# Altium schematic sheet Sensors.SchDoc
size A4; SheetNumber: 3; SheetTotal: 4
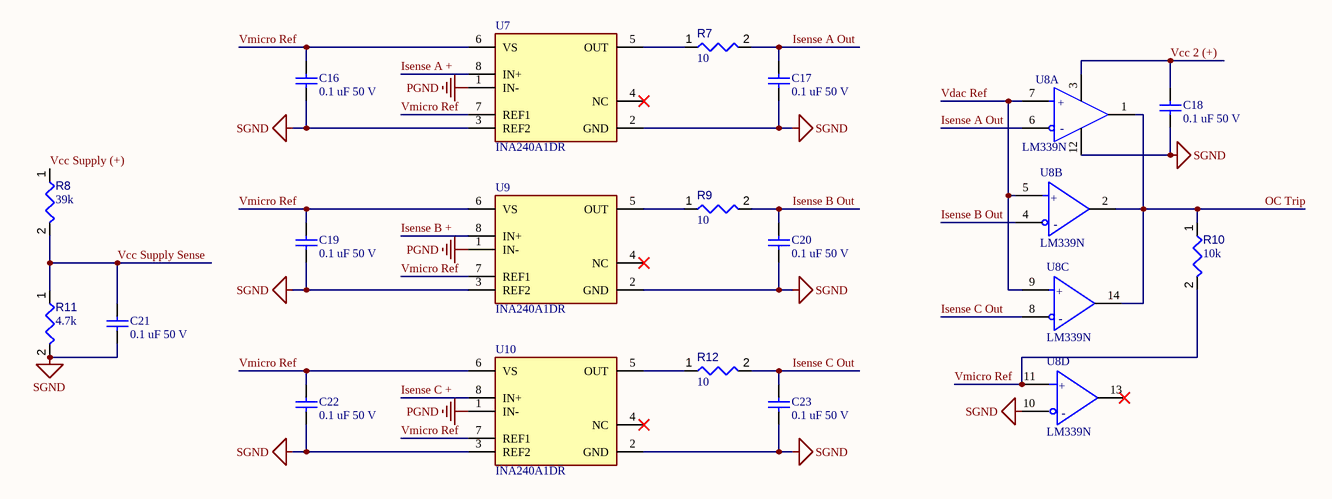
[diagram p0: Sensors.SchDoc]

## Parts
C16  0.1 uF 50 V  [CAPR51-254-508X318X736]
C17  0.1 uF 50 V  [CAPR51-254-508X318X736]
C18  0.1 uF 50 V  [CAPR51-254-508X318X736]
C19  0.1 uF 50 V  [CAPR51-254-508X318X736]
C20  0.1 uF 50 V  [CAPR51-254-508X318X736]
C21  0.1 uF 50 V  [CAPR51-254-508X318X736]
C22  0.1 uF 50 V  [CAPR51-254-508X318X736]
C23  0.1 uF 50 V  [CAPR51-254-508X318X736]
R7  value 10  [RESA60-630X240]  (hidden comment: MFR-25FBF52-10R)
R8  value 39k  [RESA60-630X240]  (hidden comment: MFR-25FBF52-39K)
R9  value 10  [RESA60-630X240]  (hidden comment: MFR-25FBF52-10R)
R10  value 10k  [RESA60-630X240]  (hidden comment: MFR-25FBF52-10K)
R11  value 4.7k  [RESA60-630X240]  (hidden comment: MFR-25FBF52-4K7)
R12  value 10  [RESA60-630X240]  (hidden comment: MFR-25FBF52-10R)
U7  INA240A1DR  [FP-D0008A-IPC_A]
U8  LM339N  [FP-N0014A-MFG]  (parts A,B,C,D of 4)
U9  INA240A1DR  [FP-D0008A-IPC_A]
U10  INA240A1DR  [FP-D0008A-IPC_A]

## Nets
PGND: U7.1(IN-) U9.1(IN-) U10.1(IN-)
SGND: C16.1 C17.1 C18.1 C19.1 C20.1 C21.1 C22.1 C23.1 R11.2 U7.2(GND) U7.3(REF2) U8.10(4IN-) U8.12(GND) U9.2(GND) U9.3(REF2) U10.2(GND) U10.3(REF2)
Isense A +: U7.8(IN+)
Isense A Out: C17.2 R7.2 U8.6(1IN-)
Isense B +: U9.8(IN+)
Isense B Out: C20.2 R9.2 U8.4(2IN-)
Isense C +: U10.8(IN+)
Isense C Out: C23.2 R12.2 U8.8(3IN-)
OC Trip: R10.1 U8.1(1OUT) U8.2(2OUT) U8.14(OUT3)
Vcc 2 (+): C18.2 U8.3(VCC)
Vcc Supply (+): R8.1
Vcc Supply Sense: C21.2 R8.2 R11.1
Vdac Ref: U8.5(2IN+) U8.7(1IN+) U8.9(3IN+)
Vmicro Ref: C16.2 C19.2 C22.2 R10.2 U7.6(VS) U7.7(REF1) U8.11(4IN+) U9.6(VS) U9.7(REF1) U10.6(VS) U10.7(REF1)
NetR7_1: R7.1 U7.5(OUT)
NetR9_1: R9.1 U9.5(OUT)
NetR12_1: R12.1 U10.5(OUT)

Not connected (* = marked no-connect by the designer): U7 4(NC)*; U8 13(OUT4)*; U9 4(NC)*; U10 4(NC)*

## Notes on the sheet
- (in symbol CMP-0055-00143-4, part A) +; -
- (in symbol CMP-0055-00143-4, part B) +; -
- (in symbol CMP-0055-00143-4, part C) +; -
- (in symbol CMP-0055-00143-4, part D) +; -

## Library data of the parts
C16-C23 = CMP-1664-00004-1: Radial Leaded Multilayer Ceramic Capacitor, 0.1 uF, +/- 10%, 50 V, -55 to 125 degC, 2-Pin THD, RoHS, Tape and Reel; Case\Package: SOT-23-5; Max Power Dissipation: 250 mW; Output Current: 150 mA; Dropout Voltage: 260 mV; Outputs: 1; Output Voltage: 5 V; Max Input Voltage: 8 V; Min Operating Temperature: -40 degC; Packaging: Tape and Reel; Height: 1.3 mm; Radiation Hardening: No; Pins: 5; ComponentLink1Description: Manufacturer URL; Mount: Surface Mount; RoHSCompliant: true; Max Operating Temperature: 85 degC; PackageReference: CAPR51-254-508X318X736; ComponentLink2URL: http://www.kemet.com/docfinder?Partnumber=C320C104K5R5TA; PackageDescription: 2-Pin Through Hole Device, Body 5.08 x 3.18 mm, Pitch 2.54 mm; ComponentLink1URL: http://www.kemet.com/; Width: 1.8 mm; Package Quantity: 3000; DatasheetVersion: Dec-15; Length: 3 mm; ComponentLink2Description: Datasheet
R7 R9 R12 = CMP-009-00048-4: 10 Ohms ±1% 0.25W, 1/4W Through Hole Resistor Axial Metal Film; Manufacturer: Yageo; Voltage Rating: 250V; Power: 250mW; Min Operating Temperature: -55°C; Max Operating Temperature: 155°C; Tolerance: 1%; Package Reference: MFR-25; Composition: CarbonFilm; Mounting Technology: TH; Packaging: Bulk; Case/Package: Axial; Datasheet URL: http://www.yageo.com/documents/recent/Yageo%20LR_MFR_2013.pdf; Package Quantity: 200; Manufacturer URL: http://www.yageo.com/; Package Description: 2-Pin Axial Lead, Dia 2.4 mm, Body Length 6.3 mm; Datasheet Version: Apr-13; RoHS Compliant: True
R8 = CMP-009-00048-4: 39 kOhms ±1% 0.25W, 1/4W Through Hole Resistor Axial Metal Film; Manufacturer: Yageo; Voltage Rating: 250V; Power: 250mW; Min Operating Temperature: -55°C; Max Operating Temperature: 155°C; Tolerance: 1%; Package Reference: MFR-25; Composition: CarbonFilm; Mounting Technology: TH; Packaging: Bulk; Case/Package: Axial; Datasheet URL: http://www.yageo.com/documents/recent/Yageo%20LR_MFR_2013.pdf; Package Quantity: 200; Manufacturer URL: http://www.yageo.com/; Package Description: 2-Pin Axial Lead, Dia 2.4 mm, Body Length 6.3 mm; Datasheet Version: Apr-13; RoHS Compliant: True
R10 = CMP-009-00048-4: 10 kOhms ±1% 0.25W, 1/4W Through Hole Resistor Axial Metal Film; Manufacturer: Yageo; Voltage Rating: 250V; Power: 250mW; Min Operating Temperature: -55°C; Max Operating Temperature: 155°C; Tolerance: 1%; Package Reference: MFR-25; Composition: CarbonFilm; Mounting Technology: TH; Packaging: Bulk; Case/Package: Axial; Datasheet URL: http://www.yageo.com/documents/recent/Yageo%20LR_MFR_2013.pdf; Package Quantity: 200; Manufacturer URL: http://www.yageo.com/; Package Description: 2-Pin Axial Lead, Dia 2.4 mm, Body Length 6.3 mm; Datasheet Version: Apr-13; RoHS Compliant: True
R11 = CMP-009-00048-4: 4.7 kOhms ±1% 0.25W, 1/4W Through Hole Resistor Axial Metal Film; Manufacturer: Yageo; Voltage Rating: 250V; Power: 250mW; Min Operating Temperature: -55°C; Max Operating Temperature: 155°C; Tolerance: 1%; Package Reference: MFR-25; Composition: CarbonFilm; Mounting Technology: TH; Packaging: Bulk; Case/Package: Axial; Datasheet URL: http://www.yageo.com/documents/recent/Yageo%20LR_MFR_2013.pdf; Package Quantity: 200; Manufacturer URL: http://www.yageo.com/; Package Description: 2-Pin Axial Lead, Dia 2.4 mm, Body Length 6.3 mm; Datasheet Version: Apr-13; RoHS Compliant: True
U7 U9 U10 = CMP-04895-000179-1: IC CURR SENSE 1 CIRCUIT 8SOIC; Slew Rate: 2V/µs; -3db Bandwidth: 400kHz; Input Bias Current: 90uA; Operating Supply Current: 1.8mA; Input Offset Voltage (Vos): 5uV; Number of Circuits: 1; Mount: Surface Mount; Packaging: Cut Tape; Max Operating Temperature: 125°C; Case/Package: SOIC; Min Operating Temperature: -40°C; RoHS Compliant: Yes; Number of Pins: 8
U8 = CMP-0055-00143-4: IC QUAD DIFF COMPARATOR 14-DIP; Power Dissipation: 1.05kW; Response Time: 1.3us; Max Input Current: 250nA; Max Supply Current: 500uA; Output Current: 20mA; Output Type: TTL; Max Dual Supply Voltage: 15V; Voltage Gain: 106.02dB; Min Supply Voltage: 2V; Max Power Dissipation: 1.05W; Quiescent Current: 2.5mA; Nominal Supply Current: 2mA; Input Offset Voltage (Vos): 5mV; Number of Channels: 4; Output Current per Channel: 6mA; Max Supply Voltage: 30V; Min Dual Supply Voltage: 1V; Dual Supply Voltage: 9V; REACH SVHC: No SVHC; Max Operating Temperature: 70°C; Case/Package: PDIP; Weight: 0.032734oz; Radiation Hardening: No; Min Operating Temperature: 0°C; Number of Pins: 14; Contact Plating: Gold; Package Quantity: 25; Lead Free: Lead Free; Height: 4.57mm; Packaging: Rail/Tube; Input Bias Current: 250nA; Number of Elements: 4; Mount: Through Hole; Width: 6.35mm; Length: 19.3mm